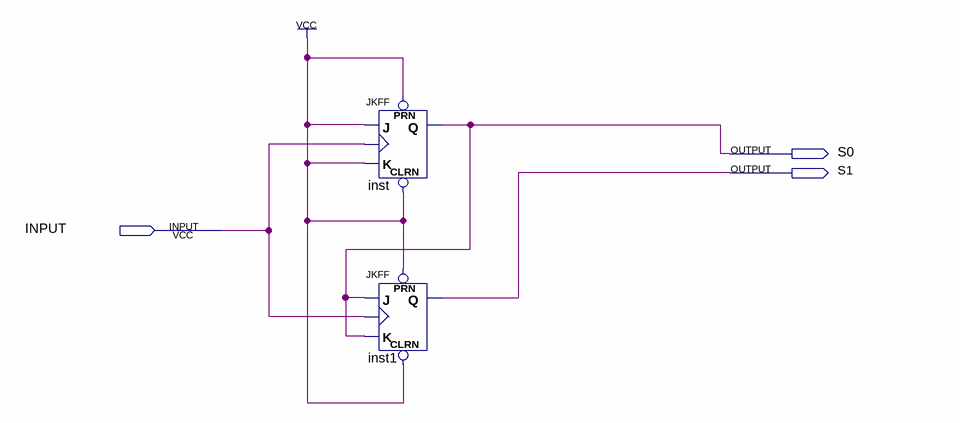
[diagram p0: schematic sheet]
// Quartus schematic CONTADOR03.bdf as structural Verilog: 2 symbols, 3 pins
module CONTADOR03 (
  input  INPUT,
  output S0,
  output S1
);

  JKFF inst (.PRN(1'b1), .CLRN(1'b1), .K(1'b1), .J(1'b1), .CLK(INPUT), .Q(S0));
  JKFF inst1 (.PRN(1'b1), .CLRN(1'b1), .K(S0), .J(S0), .CLK(INPUT), .Q(S1));
endmodule
